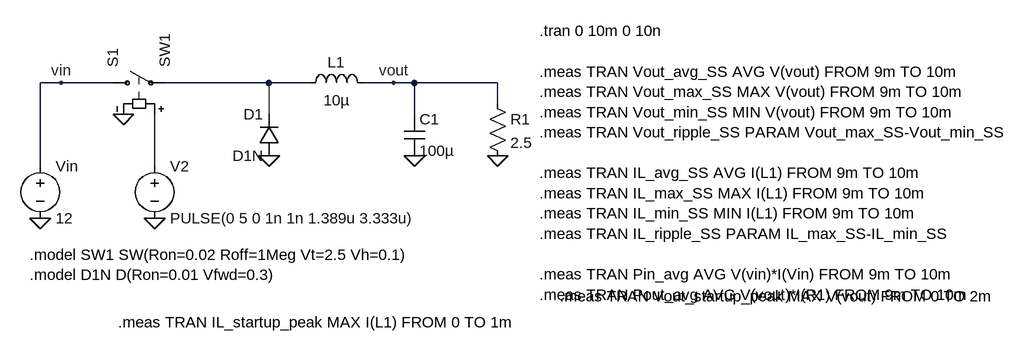
[diagram p0: schematic Draft1.asc]
Draft1.asc, the LTspice schematic file:
Version 4.1
SHEET 1 1424 680
WIRE -64 -32 -96 -32
WIRE 16 -32 -64 -32
WIRE 256 -32 96 -32
WIRE 320 -32 256 -32
WIRE 448 -32 400 -32
WIRE 480 -32 448 -32
WIRE 608 -32 480 -32
WIRE 608 0 608 -32
WIRE 256 16 256 -32
WIRE 480 16 480 -32
WIRE -96 96 -96 -32
WIRE 80 96 80 16
FLAG 32 16 0
FLAG 80 176 0
FLAG -96 176 0
FLAG 256 80 0
FLAG 480 80 0
FLAG 608 80 0
FLAG -64 -32 vin
FLAG 448 -32 vout
SYMBOL voltage -96 80 R0
WINDOW 123 0 0 Left 0
WINDOW 39 0 0 Left 0
SYMATTR InstName Vin
SYMATTR Value 12
SYMBOL voltage 80 80 R0
WINDOW 123 0 0 Left 0
WINDOW 39 0 0 Left 0
SYMATTR InstName V2
SYMATTR Value PULSE(0 5 0 1n 1n 1.389u 3.333u)
SYMBOL sw 0 -32 R270
SYMATTR InstName S1
SYMATTR Value SW1
SYMBOL diode 272 80 R180
WINDOW 0 24 64 Left 2
WINDOW 3 24 0 Left 2
SYMATTR InstName D1
SYMATTR Value D1N
SYMBOL ind 304 -16 R270
WINDOW 0 32 56 VTop 2
WINDOW 3 5 56 VBottom 2
SYMATTR InstName L1
SYMATTR Value 10µ
SYMATTR SpiceLine Rser=1m
SYMBOL cap 464 16 R0
SYMATTR InstName C1
SYMATTR Value 100µ
SYMBOL res 592 -16 R0
SYMATTR InstName R1
SYMATTR Value 2.5
TEXT 672 -112 Left 2 !.tran 0 10m 0 10n\n \n.meas TRAN Vout_avg_SS AVG V(vout) FROM 9m TO 10m\n.meas TRAN Vout_max_SS MAX V(vout) FROM 9m TO 10m\n.meas TRAN Vout_min_SS MIN V(vout) FROM 9m TO 10m\n.meas TRAN Vout_ripple_SS PARAM Vout_max_SS-Vout_min_SS\n \n.meas TRAN IL_avg_SS AVG I(L1) FROM 9m TO 10m\n.meas TRAN IL_max_SS MAX I(L1) FROM 9m TO 10m\n.meas TRAN IL_min_SS MIN I(L1) FROM 9m TO 10m\n.meas TRAN IL_ripple_SS PARAM IL_max_SS-IL_min_SS\n \n.meas TRAN Pin_avg AVG V(vin)*I(Vin) FROM 9m TO 10m\n.meas TRAN Pout_avg AVG V(vout)*I(R1) FROM 9m TO 10m
TEXT -112 232 Left 2 !.model SW1 SW(Ron=0.02 Roff=1Meg Vt=2.5 Vh=0.1)\n.model D1N D(Ron=0.01 Vfwd=0.3)
TEXT 24 336 Left 2 !.meas TRAN IL_startup_peak MAX I(L1) FROM 0 TO 1m
TEXT 704 296 Left 2 !.meas TRAN Vout_startup_peak MAX V(vout) FROM 0 TO 2m

The netlist it stands for:
* Draft1.asc
Vin vin 0 12
V2 N002 0 PULSE(0 5 0 1n 1n 1.389u 3.333u)
S1 vin N001 N002 0 SW1
D1 0 N001 D1N
L1 N001 vout 10µ Rser=1m
C1 vout 0 100µ
R1 vout 0 2.5
.model D D
.lib standard.dio
.tran 0 10m 0 10n
.meas TRAN Vout_avg_SS AVG V(vout) FROM 9m TO 10m
.meas TRAN Vout_max_SS MAX V(vout) FROM 9m TO 10m
.meas TRAN Vout_min_SS MIN V(vout) FROM 9m TO 10m
.meas TRAN Vout_ripple_SS PARAM Vout_max_SS-Vout_min_SS
.meas TRAN IL_avg_SS AVG I(L1) FROM 9m TO 10m
.meas TRAN IL_max_SS MAX I(L1) FROM 9m TO 10m
.meas TRAN IL_min_SS MIN I(L1) FROM 9m TO 10m
.meas TRAN IL_ripple_SS PARAM IL_max_SS-IL_min_SS
.meas TRAN Pin_avg AVG V(vin)*I(Vin) FROM 9m TO 10m
.meas TRAN Pout_avg AVG V(vout)*I(R1) FROM 9m TO 10m
.model SW1 SW(Ron=0.02 Roff=1Meg Vt=2.5 Vh=0.1)
.model D1N D(Ron=0.01 Vfwd=0.3)
.meas TRAN IL_startup_peak MAX I(L1) FROM 0 TO 1m
.meas TRAN Vout_startup_peak MAX V(vout) FROM 0 TO 2m
.backanno
.end